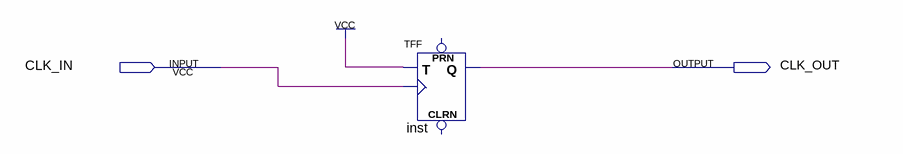
[diagram p0: schematic sheet]
// Quartus schematic CLK_DIV.bdf as structural Verilog: 1 symbols, 2 pins
module CLK_DIV (
  input  CLK_IN,
  output CLK_OUT
);

  TFF inst (.T(1'b1), .CLK(CLK_IN), .Q(CLK_OUT));  // open: PRN, CLRN
endmodule
